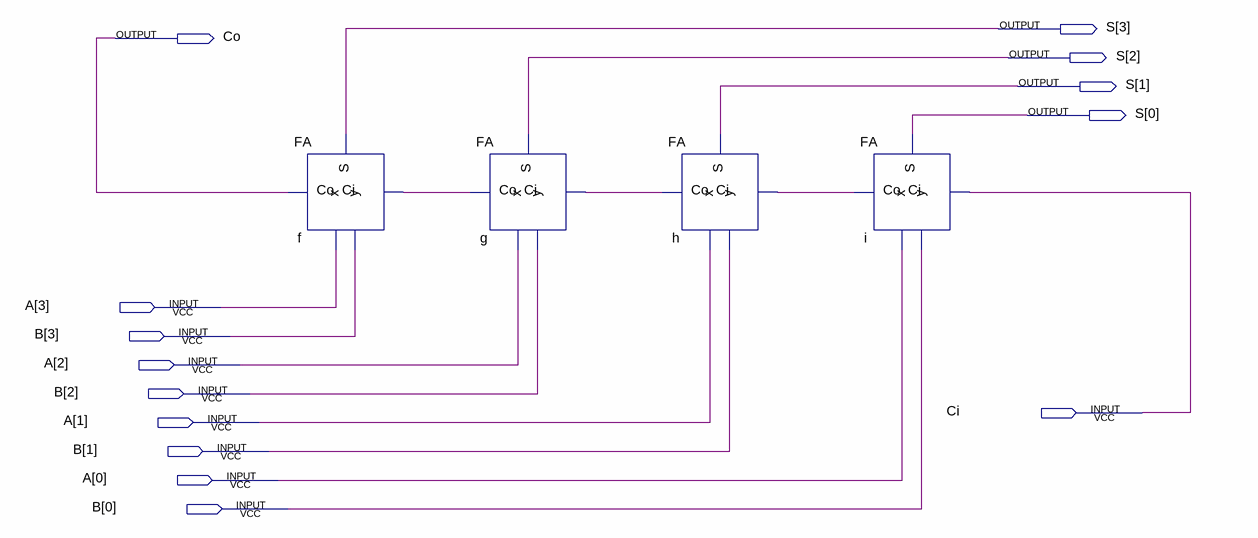
[diagram p0: schematic sheet]
// Quartus schematic FA4.bdf as structural Verilog: 4 symbols, 14 pins
module FA4 (
  input  [3:0] A,
  input  [3:0] B,
  input  Ci,
  output [3:0] S,
  output Co
);

  wire g_co, h_co, i_co;

  FA f (.Ci(g_co), .x(A[3]), .y(B[3]), .Co(Co), .S(S[3]));
  FA g (.Ci(h_co), .x(A[2]), .y(B[2]), .Co(g_co), .S(S[2]));
  FA h (.Ci(i_co), .x(A[1]), .y(B[1]), .Co(h_co), .S(S[1]));
  FA i (.Ci(Ci), .x(A[0]), .y(B[0]), .Co(i_co), .S(S[0]));
endmodule
